# EAGLE design branch (EAGLE 6.5.0)
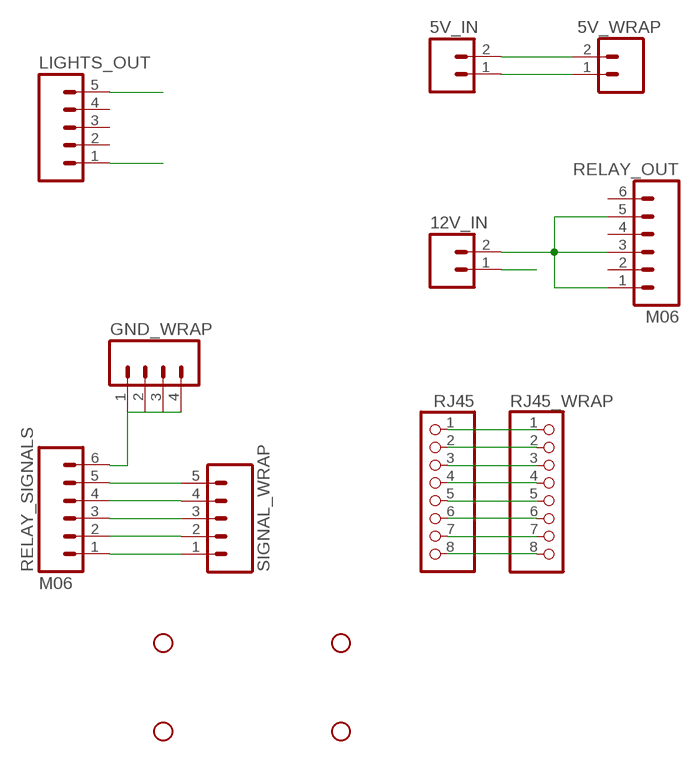
[diagram p0: schematic, sheet 1]

## Parts
5V_IN  M021X02-MTA  [1X02-MTA]
5V_WRAP  M02PTH  [1X02]
12V_IN  M021X02-MTA  [1X02-MTA]
GND_WRAP  M04PTH  [1X04]
LIGHTS_OUT  M05MTA  [1X05-MTA]
RELAY_OUT  M06  [1X06-MTA]
RELAY_SIGNALS  M06  [1X06-MTA]
RJ45  PINHD-1X8  [1X08]
RJ45_WRAP  PINHD-1X8  [1X08]
SIGNAL_WRAP  M05PTH  [1X05]
STANDOFF1  STAND-OFF  [STAND-OFF]
STANDOFF2  STAND-OFF  [STAND-OFF]
STANDOFF3  STAND-OFF  [STAND-OFF]
STANDOFF4  STAND-OFF  [STAND-OFF]

## Nets
5V: 5V_IN.2 5V_WRAP.2
12V: 12V_IN.2 RELAY_OUT.1 RELAY_OUT.3 RELAY_OUT.5
GND: 5V_IN.1 5V_WRAP.1 12V_IN.1 GND_WRAP.1 GND_WRAP.2 GND_WRAP.3 GND_WRAP.4 LIGHTS_OUT.1 RELAY_SIGNALS.6
N$1: RELAY_SIGNALS.1 SIGNAL_WRAP.1
N$2: RELAY_SIGNALS.2 SIGNAL_WRAP.2
N$3: RELAY_SIGNALS.3 SIGNAL_WRAP.3
N$4: RELAY_SIGNALS.4 SIGNAL_WRAP.4
N$5: RELAY_SIGNALS.5 SIGNAL_WRAP.5
N$6: RJ45.1 RJ45_WRAP.1
N$7: RJ45.2 RJ45_WRAP.2
N$8: RJ45.3 RJ45_WRAP.3
N$9: RJ45.4 RJ45_WRAP.4
N$10: RJ45.5 RJ45_WRAP.5
N$11: RJ45.6 RJ45_WRAP.6
N$12: RJ45.7 RJ45_WRAP.7
N$13: RJ45.8 RJ45_WRAP.8
NC: LIGHTS_OUT.5
Unconnected: LIGHTS_OUT.2 LIGHTS_OUT.3 LIGHTS_OUT.4 RELAY_OUT.2 RELAY_OUT.4 RELAY_OUT.6

## Library data of the parts
5V_IN 12V_IN = pie:M02: 2-pin 0.1-inch header and MTA connector; PARTNUMBER: A1921-ND
5V_WRAP = pie:M02: 2-pin 0.1-inch header and MTA connector
GND_WRAP = pie:M04: 4-pin 0.1-inch header and MTA connector
LIGHTS_OUT = pie:M05: 5-pin 0.1-inch header and MTA connector; PARTNUMBER: A19471-ND
RELAY_OUT RELAY_SIGNALS = pie:M06: 6-pin 0.1-inch MTA connector; PARTNUMBER: A1923-ND
RJ45 RJ45_WRAP = pie:PINHD-1X8: 8-pin 0.1-inch header; PARTNUMBER: 965
SIGNAL_WRAP = pie:M05: 5-pin 0.1-inch header and MTA connector; PARTNUMBER: 965
STANDOFF1-STANDOFF4 = pie:STAND-OFF: #4 Stand Off This is the mechanical footprint for a #4 phillips button head screw. Use the keepout ring to avoid running the screw head into surrounding components. SKU : PRT-00447

## Board
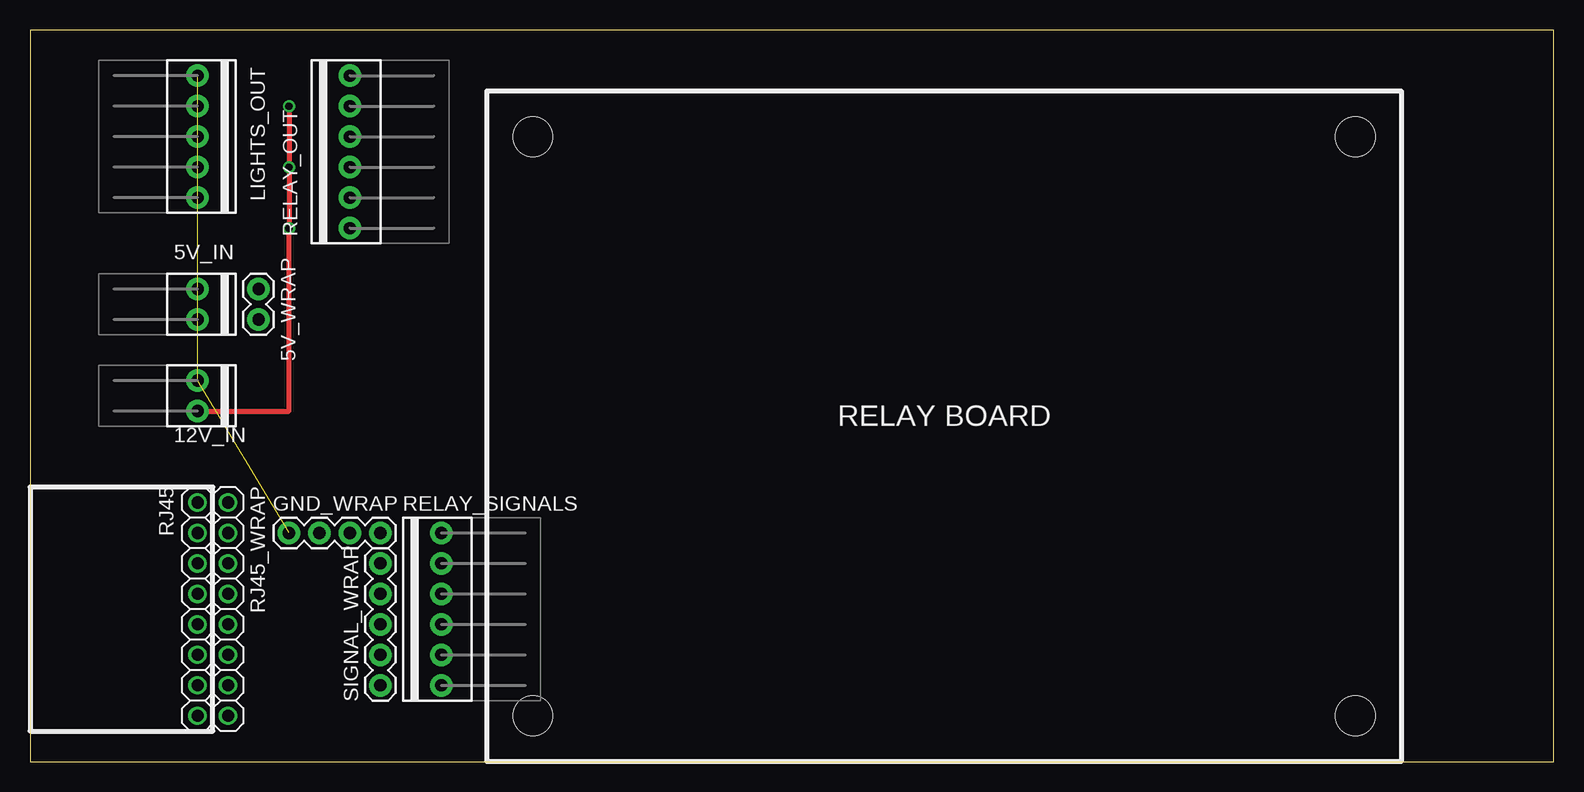
[diagram p1: board, top side]
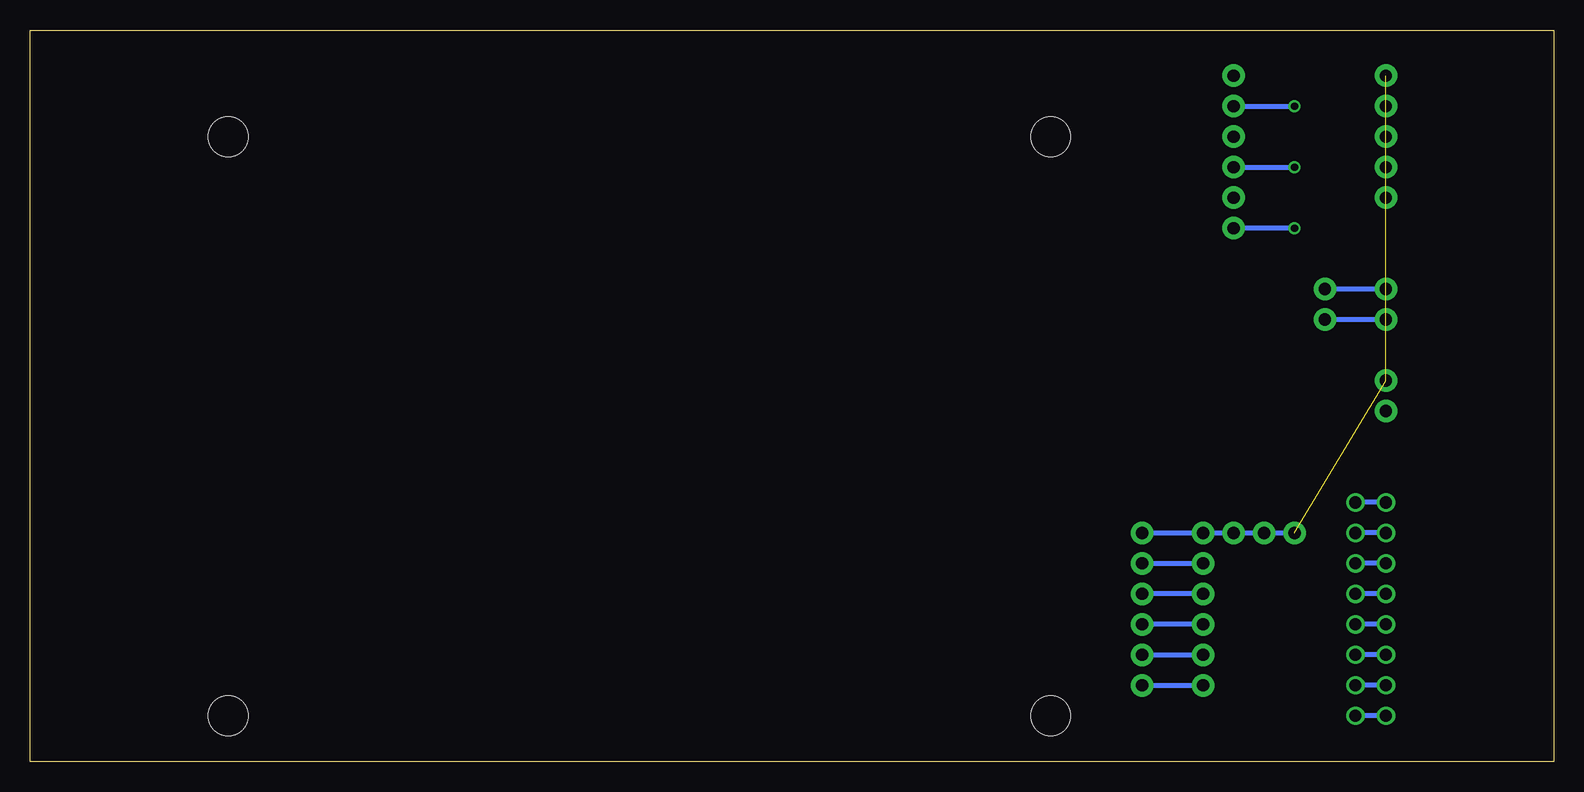
[diagram p2: board, bottom side, seen from below]

Size 127 x 60.96 mm. Coordinates in mm from the lower left corner, seen from the top.
Outline: 0,0 127,0 127,60.96 0,60.96 0,0
Copper layers (1*16): Top 0.035mm / dielectric 1.5mm / Bottom 0.035mm
Design rules "default": minimum track width 10mil, minimum drill 24mil, track to track 8mil, track to pad 8mil, pad to pad 8mil, via to via 8mil, smd to smd 8mil, copper to edge 40mil, drill to drill 8mil, minimum pad ring 10mil, minimum via ring 8mil, stop-mask expansion 4mil, vias tented up to drill 0mil, thermal gap 10mil

### Footprints (pad centres in the part's own frame; a part is rotated, then mirrored left to right if it is on the bottom)
1X02-MTA = drill 1.016 pad 1.88: 1 -1.27,0; 2 1.27,0
1X02 = drill 1.016 pad 1.88: 1 -1.27,0; 2 1.27,0
1X04 = drill 1.016 pad 1.88: 1 -3.81,0; 2 -1.27,0; 3 1.27,0; 4 3.81,0
1X05-MTA = drill 1.016 pad 1.88: 1 -5.08,0; 2 -2.54,0; 3 0,0; 4 2.54,0; 5 5.08,0
1X06-MTA = drill 1.016 pad 1.88: 1 -6.35,0; 2 -3.81,0; 3 -1.27,0; 4 1.27,0; 5 3.81,0; 6 6.35,0
1X08 = drill 1.016 pad 1.524: 1 -8.89,0; 2 -6.35,0; 3 -3.81,0; 4 -1.27,0; 5 1.27,0; 6 3.81,0; 7 6.35,0; 8 8.89,0
1X05 = drill 1.016 pad 1.88: 1 -5.08,0; 2 -2.54,0; 3 0,0; 4 2.54,0; 5 5.08,0
STAND-OFF = hole 3.302: 0,0

### Placement (x,y rotation side)
5V_IN  13.97,38.1 270 top
5V_WRAP  19.05,38.1 270 top
12V_IN  13.97,30.48 270 top
GND_WRAP  25.4,19.05 0 top
LIGHTS_OUT  13.97,52.07 270 top
RELAY_OUT  26.67,50.8 90 top
RELAY_SIGNALS  34.29,12.7 90 top
RJ45  13.97,12.7 270 top
RJ45_WRAP  16.51,12.7 270 top
SIGNAL_WRAP  29.21,11.43 90 top
STANDOFF1  41.91,3.81 0 top
STANDOFF2  41.91,52.07 0 top
STANDOFF3  110.49,3.81 0 top
STANDOFF4  110.49,52.07 0 top

### Tracks (layer width: path | path; a pad name or v marks a point on that pad's centre or on a via)
5V
  Bottom 0.406: 5V_IN.2 5V_WRAP.2
12V  (via drill 0.6)
  Top 0.406: 12V_IN.2 21.59,29.21 v21.59,44.45 v21.59,49.53 v21.59,54.61
  Bottom 0.406: v21.59,44.45 RELAY_OUT.1 | RELAY_OUT.3 v21.59,49.53 | RELAY_OUT.5 v21.59,54.61
GND  (3 unrouted)
  Bottom 0.406: 5V_IN.1 5V_WRAP.1 | RELAY_SIGNALS.6 GND_WRAP.4 GND_WRAP.3 GND_WRAP.2 GND_WRAP.1
N$1
  Bottom 0.406: RELAY_SIGNALS.1 SIGNAL_WRAP.1
N$2
  Bottom 0.406: RELAY_SIGNALS.2 SIGNAL_WRAP.2
N$3
  Bottom 0.406: SIGNAL_WRAP.3 RELAY_SIGNALS.3
N$4
  Bottom 0.406: SIGNAL_WRAP.4 RELAY_SIGNALS.4
N$5
  Bottom 0.406: RELAY_SIGNALS.5 SIGNAL_WRAP.5
N$6
  Bottom 0.406: RJ45.1 RJ45_WRAP.1
N$7
  Bottom 0.406: RJ45.2 RJ45_WRAP.2
N$8
  Bottom 0.406: RJ45.3 RJ45_WRAP.3
N$9
  Bottom 0.406: RJ45.4 RJ45_WRAP.4
N$10
  Bottom 0.406: RJ45.5 RJ45_WRAP.5
N$11
  Bottom 0.406: RJ45.6 RJ45_WRAP.6
N$12
  Bottom 0.406: RJ45.7 RJ45_WRAP.7
N$13
  Bottom 0.406: RJ45.8 RJ45_WRAP.8

### Text on the board
tNames: RELAY BOARD